# Altium schematic sheet DAC_filter_stage.SchDoc
size A3; SheetNumber: 3; SheetTotal: 7
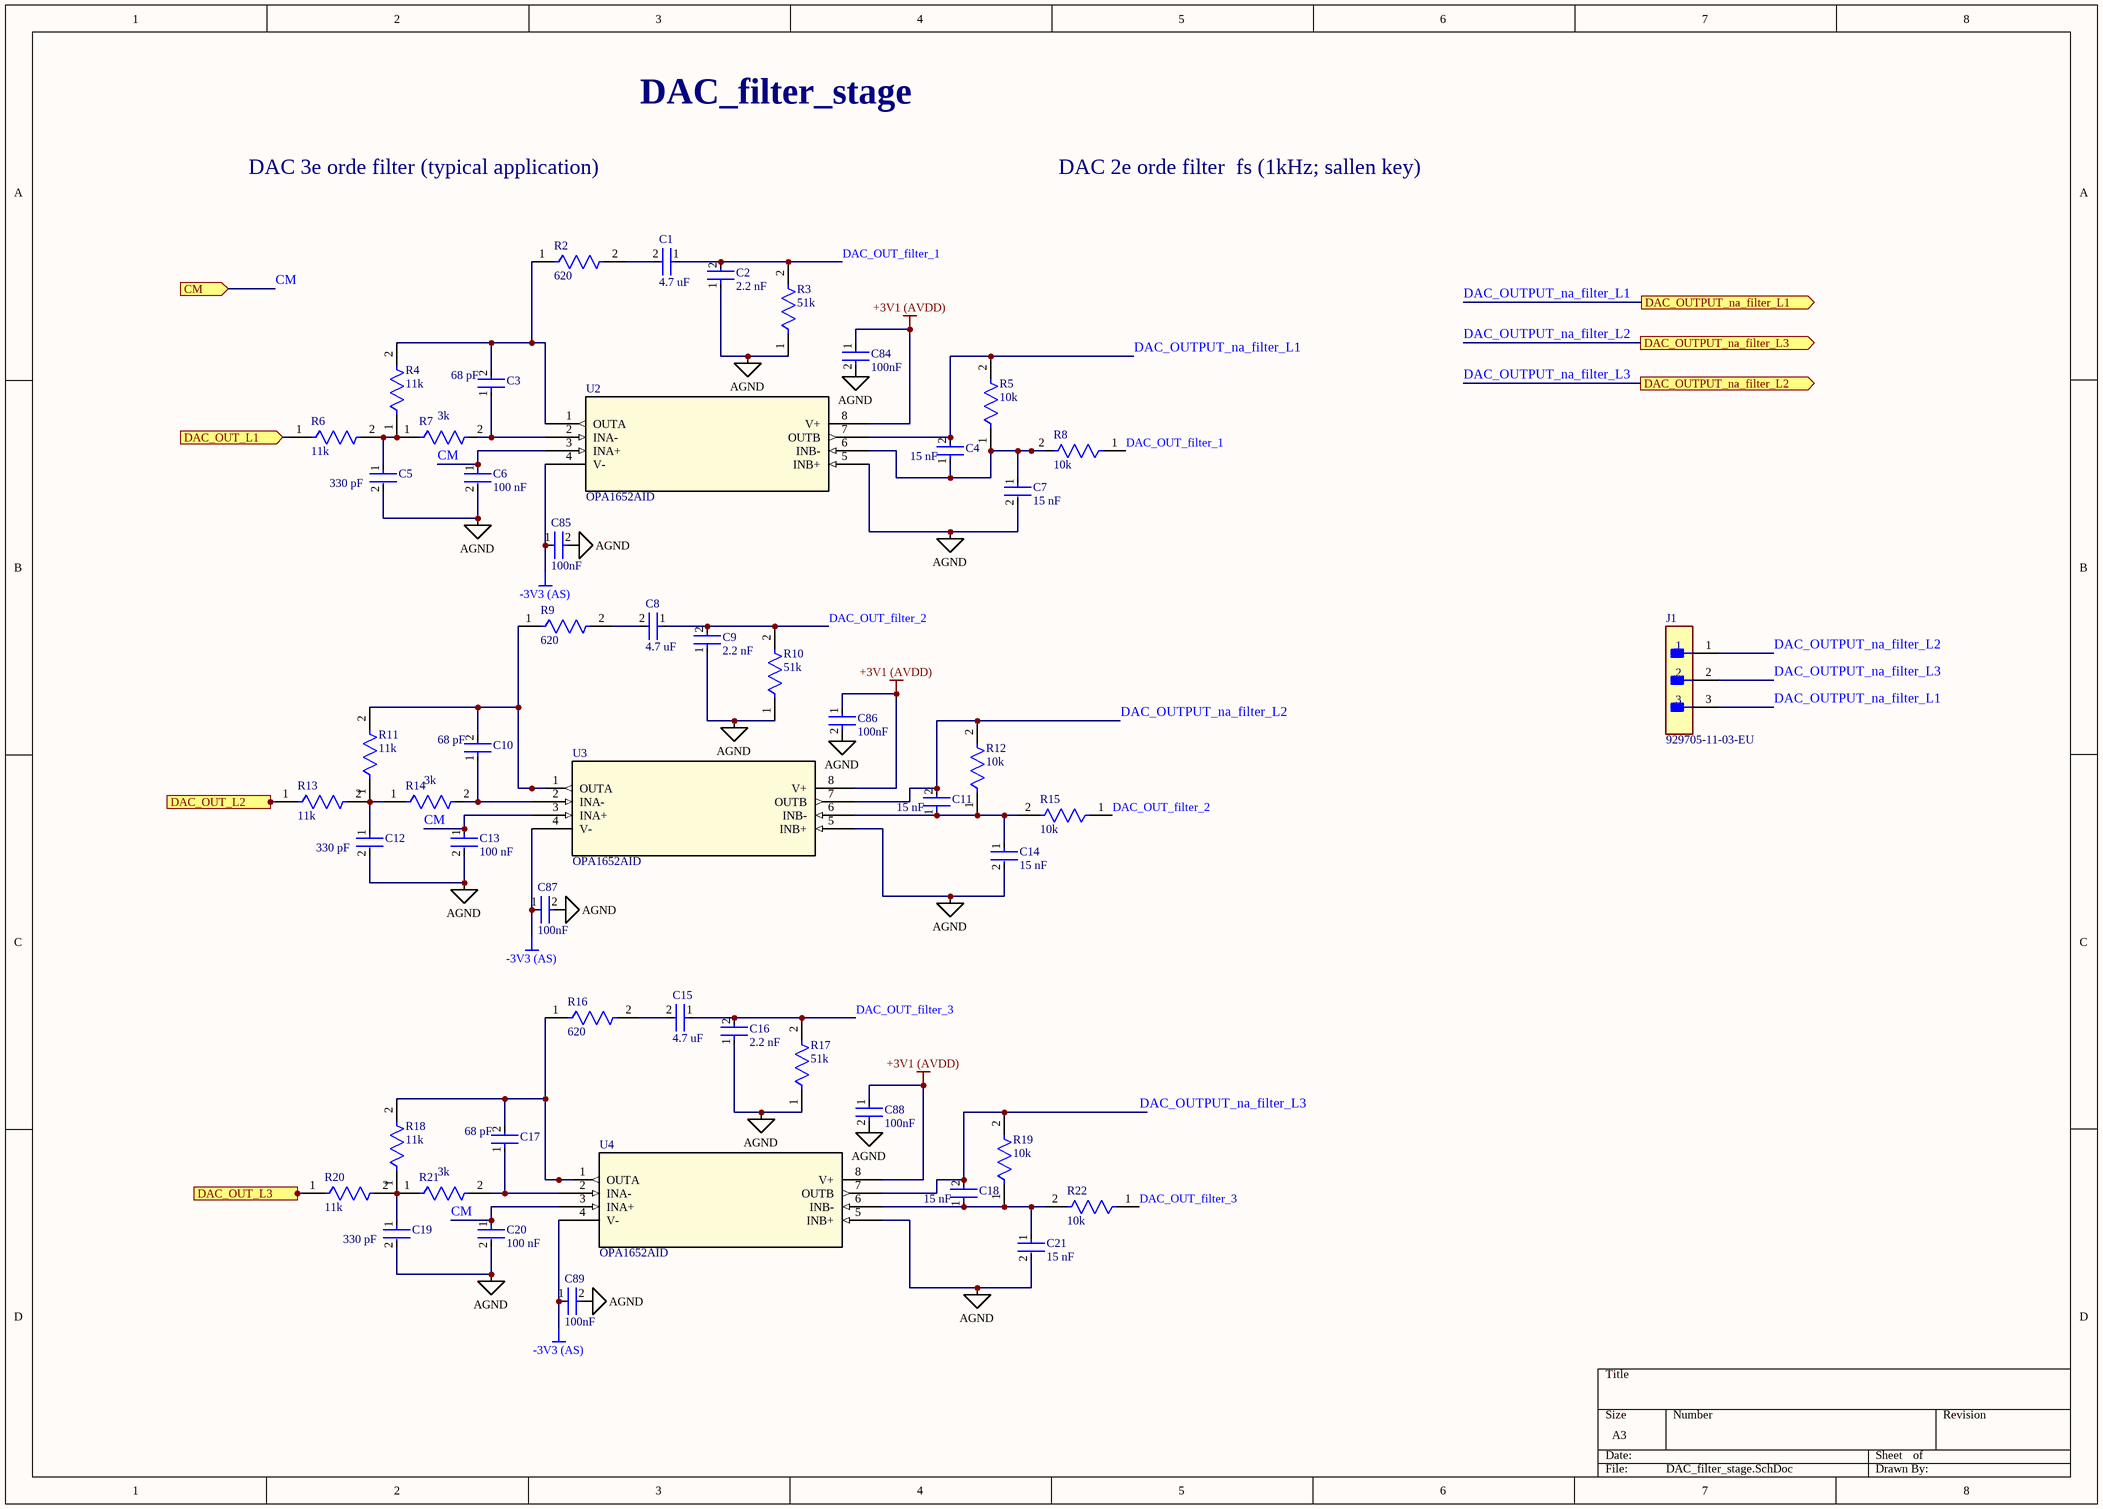
[diagram p0: DAC_filter_stage.SchDoc]

## Parts
C1  4.7 uF  [FP-C0603C-CF-MFG]
C2  2.2 nF  [FP-AC0603-MFG]
C3  68 pF  [FP-AC0603-MFG]
C4  15 nF  [FP-C0603C-CF-MFG]
C5  330 pF  [FP-AC0603-MFG]
C6  100 nF  [FP-C0603C-CF-MFG]
C7  15 nF  [FP-C0603C-CF-MFG]
C8  4.7 uF  [FP-C0603C-CF-MFG]
C9  2.2 nF  [FP-AC0603-MFG]
C10  68 pF  [FP-AC0603-MFG]
C11  15 nF  [FP-C0603C-CF-MFG]
C12  330 pF  [FP-AC0603-MFG]
C13  100 nF  [FP-C0603C-CF-MFG]
C14  15 nF  [FP-C0603C-CF-MFG]
C15  4.7 uF  [FP-C0603C-CF-MFG]
C16  2.2 nF  [FP-AC0603-MFG]
C17  68 pF  [FP-AC0603-MFG]
C18  15 nF  [FP-C0603C-CF-MFG]
C19  330 pF  [FP-AC0603-MFG]
C20  100 nF  [FP-C0603C-CF-MFG]
C21  15 nF  [FP-C0603C-CF-MFG]
C84  100nF  [FP-GRM15-MFG]
C85  100nF  [FP-GRM15-MFG]
C86  100nF  [FP-GRM15-MFG]
C87  100nF  [FP-GRM15-MFG]
C88  100nF  [FP-GRM15-MFG]
C89  100nF  [FP-GRM15-MFG]
J1  929705-11-03-EU  [FP-929705-11-03-EU-MFG]
R2  620  [FP-RC1608-IPC_B]
R3  51k  [FP-RC1608-IPC_B]
R4  11k  [FP-RC1608-IPC_B]
R5  10k  [FP-RC1608-IPC_B]
R6  11k  [FP-RC1608-IPC_B]
R7  3k  [FP-RC1608-IPC_B]
R8  10k  [FP-RC1608-IPC_B]
R9  620  [FP-RC1608-IPC_B]
R10  51k  [FP-RC1608-IPC_B]
R11  11k  [FP-RC1608-IPC_B]
R12  10k  [FP-RC1608-IPC_B]
R13  11k  [FP-RC1608-IPC_B]
R14  3k  [FP-RC1608-IPC_B]
R15  10k  [FP-RC1608-IPC_B]
R16  620  [FP-RC1608-IPC_B]
R17  51k  [FP-RC1608-IPC_B]
R18  11k  [FP-RC1608-IPC_B]
R19  10k  [FP-RC1608-IPC_B]
R20  11k  [FP-RC1608-IPC_B]
R21  3k  [FP-RC1608-IPC_B]
R22  10k  [FP-RC1608-IPC_B]
U2  OPA1652AID  [D8]
U3  OPA1652AID  [D8]
U4  OPA1652AID  [D8]

## Ports
CM (in, see DAC[3C]), DAC_OUT_L1 (in, see DAC[3C]), DAC_OUT_L2 (in, see DAC[3C]), DAC_OUT_L3 (in, see DAC[3C]), DAC_OUTPUT_na_filter_L1 (out, see DAC[4C]), DAC_OUTPUT_na_filter_L2 (out, see DAC[4C]), DAC_OUTPUT_na_filter_L3 (out, see DAC[4C])

## Nets
+3V1 (AVDD): C84.1 C86.1 C88.1 U2.8(V+) U3.8(V+) U4.8(V+)
-3V3 (AS): C85.1 C87.1 C89.1 U2.4(V-) U3.4(V-) U4.4(V-)
AGND: C2.1 C5.2 C6.2 C7.2 C9.1 C12.2 C13.2 C14.2 C16.1 C19.2 C20.2 C21.2 C84.2 C85.2 C86.2 C87.2 C88.2 C89.2 R3.1 R10.1 R17.1 U2.5(INB+) U3.5(INB+) U4.5(INB+)
CM: C6.1 C13.1 C20.1 U2.3(INA+) U3.3(INA+) U4.3(INA+) ; port CM
DAC_OUT_filter_1: C1.1 C2.2 R3.2 R8.1
DAC_OUT_filter_2: C8.1 C9.2 R10.2 R15.1
DAC_OUT_filter_3: C15.1 C16.2 R17.2 R22.1
DAC_OUT_L1: R6.1 ; port DAC_OUT_L1
DAC_OUT_L2: R13.1 ; port DAC_OUT_L2
DAC_OUT_L3: R20.1 ; port DAC_OUT_L3
DAC_OUTPUT_na_filter_L1: C4.2 J1.3 R5.2 U2.7(OUTB) ; port DAC_OUTPUT_na_filter_L1
DAC_OUTPUT_na_filter_L2: C11.2 J1.1 R12.2 U3.7(OUTB) ; port DAC_OUTPUT_na_filter_L3
DAC_OUTPUT_na_filter_L3: C18.2 J1.2 R19.2 U4.7(OUTB) ; port DAC_OUTPUT_na_filter_L2
NetC1_2: C1.2 R2.2
NetC3_1: C3.1 R7.2 U2.2(INA-)
NetC3_2: C3.2 R2.1 R4.2 U2.1(OUTA)
NetC4_1: C4.1 C7.1 R5.1 R8.2 U2.6(INB-)
NetC5_1: C5.1 R4.1 R6.2 R7.1
NetC8_2: C8.2 R9.2
NetC10_1: C10.1 R14.2 U3.2(INA-)
NetC10_2: C10.2 R9.1 R11.2 U3.1(OUTA)
NetC11_1: C11.1 C14.1 R12.1 R15.2 U3.6(INB-)
NetC12_1: C12.1 R11.1 R13.2 R14.1
NetC15_2: C15.2 R16.2
NetC17_1: C17.1 R21.2 U4.2(INA-)
NetC17_2: C17.2 R16.1 R18.2 U4.1(OUTA)
NetC18_1: C18.1 C21.1 R19.1 R22.2 U4.6(INB-)
NetC19_1: C19.1 R18.1 R20.2 R21.1

## Notes on the sheet
- DAC_filter_stage
- DAC 3e orde filter (typical application)
- DAC 2e orde filter  fs (1kHz; sallen key)

## Library data of the parts
C1 C8 C15 = CMP-2006-03056-2: CAP CER 4.7 UF 50V 5% X7R 0603; Manufacturer Part Number: C0603C104J5RACTU; Manufacturer: KEMET; Generic part Eurocircuits:: GPC0603475-10; Automotive Grade: Grade 1; Tolerance: 0.05; Capacitance: 4.7 μF; Value: 4.7 μF; Material: Ceramic; Temperature Coefficient: 30ppm/°C; ComponentLink2Description: Datasheet; Voltage Rating: 50 V; Digikey Description: CAP CER 0.1UF 50V 5% X7R 0603; Temperature Range High: +125°C; Device Class L2: Capacitors; Octopart: https://octopart.com/c0603c104j5ractu-kemet-10440638; RoHS: TRUE; Mouser Description: Multilayer Ceramic Capacitors MLCC - SMD/SMT 50volts 0.1uF X7R 5%; Temperature Range Low: -55°C; Automotive: Yes; Lead Free: Yes; ComponentLink2URL: https://api.kemet.com/component-edge/download/datasheet/C0603C100J5GACAUTO.pdf; Device Class L3: Ceramic Capacitors; Package: C0603C-CF; Category: Cap; Temperature: -55°C to +125°C; Height: 0.87mm; Temperature Characteristic: X7R; Device Class L1: Passive Components
C2 C9 C16 = CMP-03422-001062-1: AC0603 2.2 pF NP0 5.00% 50 V; Manufacturer Part Number: AC0603JRNPO9BN271; Manufacturer: Yageo; Generic part Eurocircuits:: GPC0603222; Material: Ceramic; Tolerance: 0.05; Voltage Rating: 50 V; Temperature Coefficient: 15%; Automotive Grade: Grade 1; ComponentLink2URL: http://www.yageo.com/documents/recent/UPY-AC_NP0X7R_16V-to-630V_12.pdf; Value: 2.2 nF; Capacitance: 2.2 nF; Lead Free: Yes; Automotive: Yes; Package: AC0603; RoHS: TRUE; Device Class L2: Capacitors; Footprint Url: http://www.yageo.com/exep/pages/download/literatures/UPY-C_GEN_24.pdf; Height: 0.9mm; Category: Cap; Device Class L1: Passive Components; Temperature: -55°C to +125°C; Ipc Land Pattern Name: CAPC16080X80; Octopart: https://octopart.com/ac0603jrnpo9bn271-yageo-87214073; ComponentLink2Description: Datasheet; Device Class L3: Ceramic Capacitors; Temperature Characteristic: NP0; Temperature Range High: +125°C; Temperature Range Low: -55°C
C3 C10 C17 = CMP-03422-001062-1: AC0603 68 pF NP0 5.00% 50 V; Manufacturer Part Number: AC0603JRNPO9BN271; Manufacturer: Yageo; Generic part Eurocircuits:: GPC0603680; Material: Ceramic; Tolerance: 0.05; Voltage Rating: 50 V; Temperature Coefficient: 15%; Automotive Grade: Grade 1; ComponentLink2URL: http://www.yageo.com/documents/recent/UPY-AC_NP0X7R_16V-to-630V_12.pdf; Value: 68 pF; Capacitance: 68 pF; Lead Free: Yes; Automotive: Yes; Package: AC0603; RoHS: TRUE; Device Class L2: Capacitors; Footprint Url: http://www.yageo.com/exep/pages/download/literatures/UPY-C_GEN_24.pdf; Height: 0.9mm; Category: Cap; Device Class L1: Passive Components; Temperature: -55°C to +125°C; Ipc Land Pattern Name: CAPC16080X80; Octopart: https://octopart.com/ac0603jrnpo9bn271-yageo-87214073; ComponentLink2Description: Datasheet; Device Class L3: Ceramic Capacitors; Temperature Characteristic: NP0; Temperature Range High: +125°C; Temperature Range Low: -55°C
C4 C7 C11 C14 C18 C21 = CMP-2006-03056-2: CAP CER 15 nF 50V 5% X7R 0603                                           Eurocircuits generic components:                                 GPC0603153; Manufacturer Part Number: C0603C104J5RACTU; Manufacturer: KEMET; Automotive Grade: Grade 1; Tolerance: 0.05; Material: Ceramic; Temperature Coefficient: 30ppm/°C; ComponentLink2Description: Datasheet; Voltage Rating: 50 V; Digikey Description: CAP CER 0.1UF 50V 5% X7R 0603; Temperature Range High: +125°C; Device Class L2: Capacitors; Capacitance: 15 nF; Value: 15 nF; Octopart: https://octopart.com/c0603c104j5ractu-kemet-10440638; RoHS: TRUE; Mouser Description: Multilayer Ceramic Capacitors MLCC - SMD/SMT 50volts 0.1uF X7R 5%; Temperature Range Low: -55°C; Automotive: Yes; Lead Free: Yes; ComponentLink2URL: https://api.kemet.com/component-edge/download/datasheet/C0603C100J5GACAUTO.pdf; Device Class L3: Ceramic Capacitors; Package: C0603C-CF; Category: Cap; Temperature: -55°C to +125°C; Height: 0.87mm; Temperature Characteristic: X7R; Device Class L1: Passive Components; Generic part Eurocircuits:: GPC0603153
C5 C12 C19 = CMP-03422-001062-1: AC0603 330 pF NP0 5.00% 50 V; Manufacturer Part Number: AC0603JRNPO9BN271; Manufacturer: Yageo; Generic part Eurocircuits:: GPC0603331; Material: Ceramic; Tolerance: 0.05; Voltage Rating: 50 V; Temperature Coefficient: 15%; Automotive Grade: Grade 1; ComponentLink2URL: http://www.yageo.com/documents/recent/UPY-AC_NP0X7R_16V-to-630V_12.pdf; Value: 330 pF; Capacitance: 330 pF; Lead Free: Yes; Automotive: Yes; Package: AC0603; RoHS: TRUE; Device Class L2: Capacitors; Footprint Url: http://www.yageo.com/exep/pages/download/literatures/UPY-C_GEN_24.pdf; Height: 0.9mm; Category: Cap; Device Class L1: Passive Components; Temperature: -55°C to +125°C; Ipc Land Pattern Name: CAPC16080X80; Octopart: https://octopart.com/ac0603jrnpo9bn271-yageo-87214073; ComponentLink2Description: Datasheet; Device Class L3: Ceramic Capacitors; Temperature Characteristic: NP0; Temperature Range High: +125°C; Temperature Range Low: -55°C
C6 C13 C20 = CMP-2006-03056-2: CAP CER 100 nF 50V 5% X7R 0603; Manufacturer Part Number: C0603C104J5RACTU; Manufacturer: KEMET; Generic part Eurocircuits:: GPC0603104; Automotive Grade: Grade 1; Tolerance: 0.05; Material: Ceramic; Temperature Coefficient: 30ppm/°C; ComponentLink2Description: Datasheet; Voltage Rating: 50 V; Digikey Description: CAP CER 0.1UF 50V 5% X7R 0603; Temperature Range High: +125°C; Device Class L2: Capacitors; Capacitance: 100 nF; Value: 100 nF; Octopart: https://octopart.com/c0603c104j5ractu-kemet-10440638; RoHS: TRUE; Mouser Description: Multilayer Ceramic Capacitors MLCC - SMD/SMT 50volts 0.1uF X7R 5%; Temperature Range Low: -55°C; Automotive: Yes; Lead Free: Yes; ComponentLink2URL: https://api.kemet.com/component-edge/download/datasheet/C0603C100J5GACAUTO.pdf; Device Class L3: Ceramic Capacitors; Package: C0603C-CF; Category: Cap; Temperature: -55°C to +125°C; Height: 0.87mm; Temperature Characteristic: X7R; Device Class L1: Passive Components
C84-C89 = CMP-2100-03641-2: CAP CER 0.1UF 16V X7R 0402; Manufacturer Part Number: GRM155R71C104KA88D; Manufacturer: Murata; Eurocircuits generic parts: GPC0402104; Standoff Height: 0mm; Tolerance: 10%; Voltage Rating: 16Vdc; Material: Ceramic; Capacitance: 0.10μF; Value: 0.10μF; RoHS: TRUE; Temperature Characteristic: X7R; Octopart: https://octopart.com/grm155r71c104ka88d-murata-196880; Digikey Description: CAP CER 0.1UF 16V X7R 0402; Device Class L3: Ceramic Capacitors; Height: 0.55mm; ComponentLink2Description: Datasheet; Temperature Range Low: -55°C; Ipc Land Pattern Name: CAPC10050X219; ComponentLink2URL: https://search.murata.co.jp/Ceramy/image/img/A01X/G101/ENG/GRM155R71H471KA01-01A.pdf; Device Class L1: Passive Components; Lead Free: yes; Category: Cap; Package: GRM15; Temperature: -55°C to +125°C; Device Class L2: Capacitors; Temperature Range High: +125°C; Mouser Description: 0402 0.1 uF 16V ±10 % Tolerance X7R SMT Multilayer Ceramic Capacitor
J1 = CMP-05379-000017-1: CONN HEADER VERT 3POS 2.54MM / Euro circruits generic component: / GPHA-1X03; Gender: Male; Connector Type: Male Pin; Current Rating: 2.5A; Voltage Rating: 1.5kV; Number of Positions: 3; Orientation: Straight; Color: Black; Contact Material: Copper Alloy; Housing Color: Black; Series: 929; Contact Plating: Gold; Depth: 2.92mm; Max Current Rating: 2.5A; Mount: Through Hole; Number of Rows: 1; Min Operating Temperature: -40°C; Termination: Solder; Package Quantity: 100; Max Operating Temperature: 105°C; Contact Gender: Male; Length: 7.6mm; Contact Type: Male Pin; Contact Mating Length: 0.318inch; Housing Material: Polycyclohexylenedimethylene; Pitch: 2.54mm; RoHS Compliant: Yes; Packaging: Bulk; Eurocircuits_generic_part_number: GPHA-1X03
R2 R9 R16 = CMP-13261-004935-1: Res Thick Film 0603 620Ω 1% 0.1W ±100ppm/°C Molded SMD T/R; Generic part Eurocircuits:: GPR0603620R; Voltage Rating (DC): 50V; Power Rating: 100mW; Resistance: 620; Contact Plating: Tin; Depth: 0.8mm; Width: 800um; Tolerance: 1%; Lead Free: Lead Free; Composition: Thick Film; Military Standard: Not; Temperature Coefficient: 100ppm/°C; Radiation Hardening: No; Length: 1.6mm; Case/Package: 0603; Max Operating Temperature: 155°C; Packaging: Tape and Reel; Min Operating Temperature: -55°C
R3 R10 R17 = CMP-13261-004935-1: Res Thick Film 0603 51kΩ 1% 0.1W ±100ppm/°C Molded SMD T/R; Generic part Eurocircuits:: GPR060351K; Voltage Rating (DC): 50V; Power Rating: 100mW; Resistance: 51k; Contact Plating: Tin; Depth: 0.8mm; Width: 800um; Tolerance: 1%; Lead Free: Lead Free; Composition: Thick Film; Military Standard: Not; Temperature Coefficient: 100ppm/°C; Radiation Hardening: No; Length: 1.6mm; Case/Package: 0603; Max Operating Temperature: 155°C; Packaging: Tape and Reel; Min Operating Temperature: -55°C
R4 R6 R11 R13 R18 R20 = CMP-13261-004935-1: Res Thick Film 0603 11kΩ 1% 0.1W ±100ppm/°C Molded SMD T/R; Generic part Eurocircuits:: GPR060311K; Voltage Rating (DC): 50V; Power Rating: 100mW; Resistance: 11k; Contact Plating: Tin; Depth: 0.8mm; Width: 800um; Tolerance: 1%; Lead Free: Lead Free; Composition: Thick Film; Military Standard: Not; Temperature Coefficient: 100ppm/°C; Radiation Hardening: No; Length: 1.6mm; Case/Package: 0603; Max Operating Temperature: 155°C; Packaging: Tape and Reel; Min Operating Temperature: -55°C
R5 R8 R12 R15 R19 R22 = CMP-13261-004935-1: Res Thick Film 0603 10kΩ 1% 0.1W ±100ppm/°C Molded SMD T/R / Generic part Eurocircuits: / GPR060310K; Voltage Rating (DC): 50V; Power Rating: 100mW; Resistance: 10k; Contact Plating: Tin; Depth: 0.8mm; Width: 800um; Tolerance: 1%; Lead Free: Lead Free; Composition: Thick Film; Military Standard: Not; Temperature Coefficient: 100ppm/°C; Radiation Hardening: No; Length: 1.6mm; Case/Package: 0603; Max Operating Temperature: 155°C; Packaging: Tape and Reel; Min Operating Temperature: -55°C; Generic part Eurocircuits:: GPR060310K
R7 R14 R21 = CMP-13261-004935-1: Res Thick Film 0603 3kΩ 1% 0.1W ±100ppm/°C Molded SMD T/R; Generic part Eurocircuits:: GPR06033K; Voltage Rating (DC): 50V; Power Rating: 100mW; Resistance: 3k; Contact Plating: Tin; Depth: 0.8mm; Width: 800um; Tolerance: 1%; Lead Free: Lead Free; Composition: Thick Film; Military Standard: Not; Temperature Coefficient: 100ppm/°C; Radiation Hardening: No; Length: 1.6mm; Case/Package: 0603; Max Operating Temperature: 155°C; Packaging: Tape and Reel; Min Operating Temperature: -55°C
U2-U4 = OPA1652AID: No Description Available; Mfr_Name: Texas Instruments; RefDes: RefDes; Type: Type